# Altium schematic sheet Telemetry_868Mhz.SchDoc: 868Mhz_Test_Card
size A4; DrawnBy: Huseyin; Revision: 1; SheetNumber: 1; SheetTotal: 1
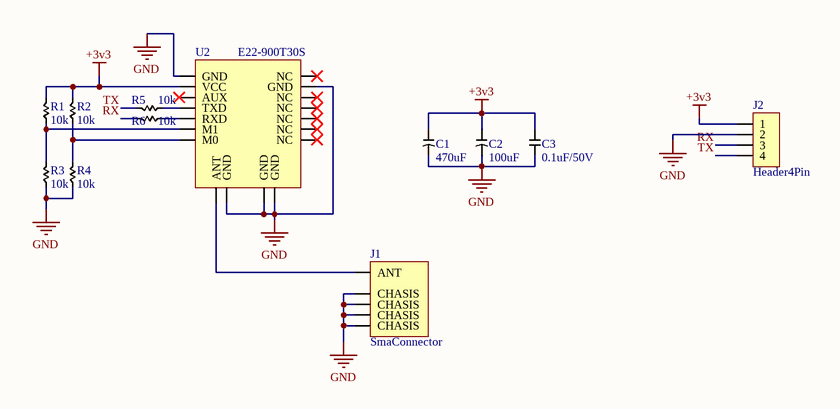
[diagram p0: Telemetry_868Mhz.SchDoc]

## Parts
C1  470uF  [PKLH-016V471MG125-T/A5.0]
C2  100uF  [PKRM-035V101ME110-T/A5.0]
C3  0.1uF/50V  [Cap_0805]
J1  SmaConnector  [RightAngled_SMA_Connector]
J2  Header4Pin  [Header_4pin_Female]
R1  10k  [RES_0805]
R2  10k  [RES_0805]
R3  10k  [RES_0805]
R4  10k  [RES_0805]
R5  10k  [RES_0805]
R6  10k  [RES_0805]
U2  E22-900T30S  [E22-900T30S]

## Nets
+3v3: C1.1 C2.1 C3.1 J2.1 R1.2 R2.2 U2.6(VCC)
GND: C1.2 C2.2 C3.2 J1.2(CHASIS) J1.3(CHASIS) J1.4(CHASIS) J1.5(CHASIS) J2.2 R3.1 R4.1 U2.7(GND) U2.9(GND) U2.15(GND) U2.16(GND) U2.17(GND)
RX: J2.3 R6.2
TX: J2.4 R5.2
NetJ1_1: J1.1(ANT) U2.18(ANT)
NetR1_1: R1.1 R3.2 U2.2(M1)
NetR2_1: R2.1 R4.2 U2.1(M0)
NetR5_1: R5.1 U2.4(TXD)
NetR6_1: R6.1 U2.3(RXD)

Not connected (* = marked no-connect by the designer): U2 5(AUX)* 8(NC)* 10(NC)* 11(NC)* 12(NC)* 13(NC)* 14(NC)*

## Notes on the sheet
- Size:
- Title
- A4
- DrawnBy
- Revision:
- YBU
- Batı Kampüsü
- Etlik Keçiören
- Date:
- Time:
- Sheet
- of
- Ankara / Türkiye

## Library data of the parts
C1 = PKLH-016V471MG125-T/A5.0: CAP.EL.470uF 16V 10x12.5 5MM 105C L.ESR 3000H TB K; ComponentLink1Description: özdisan; ComponentLink1URL: https://ozdisan.com/passive-components/capacitors/aluminum-capacitors/CK1H107M10010VR
C2 = PKRM-035V101ME110-T/A5.0: CAP.EL.100uF 50V 10x10 105C TH; ComponentLink1Description: özdisan; ComponentLink1URL: https://ozdisan.com/passive-components/capacitors/aluminum-capacitors/CK1H107M10010VR
C3 = CL21B104JBCNNNC: MLCC (2012) 0805 100nF 50VDC ±5% X7R
J1 = L-KLS1-SMA002-B: RP-SMA Connector Receptacle, Male Pin 50Ohm Through Hole, Right Angle Solder; ComponentLink1Description: özdisan; ComponentLink1URL: https://ozdisan.com/connectors-and-interconnects/coaxial-connectors/sma-connectors/L-KLS1-SMA002-B
J2 = Header_4Pin: PIN HEADER 4PIN(1x4) 2.54mm THT V/T
R1-R6 = 0805S8J0103T5E: RES.(2012) 0805 10K Ohms 5% 1/8W-S 100PPM
U2 = E22-900T30S: LoRa, 868MHz 1W SMD long range, 5V Supply,RF Transmission 30 dBm, 10 k; ComponentLink1Description: M2M; ComponentLink1URL: https://www.m2mmarket.com.tr/lora-868mhz-1w-smd-long-range-5v-supplyrf-transmission-30-dbm-10-k-2153